# EAGLE design usb (EAGLE 4.16)
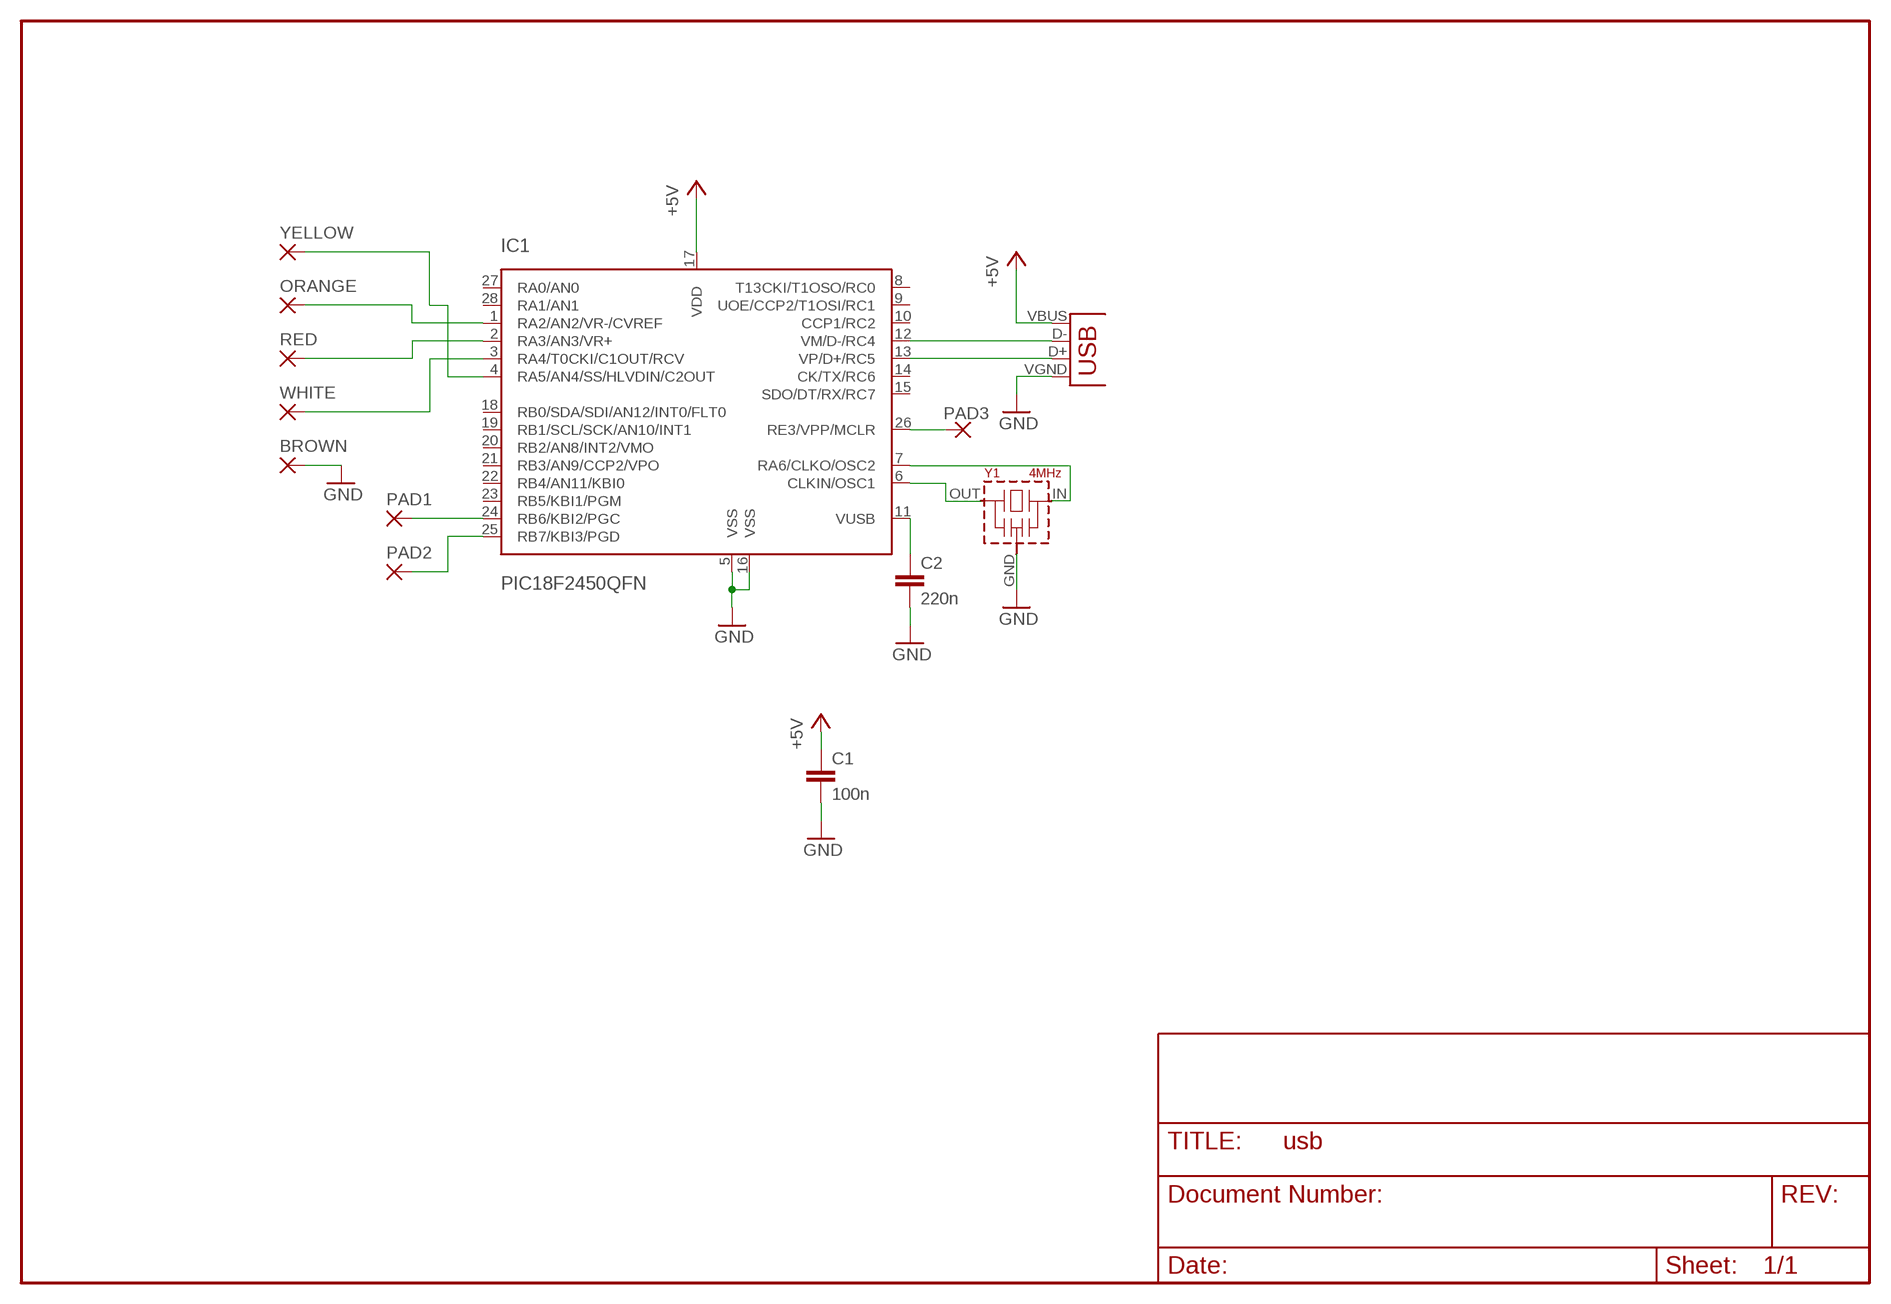
[diagram p0: schematic, sheet 1]

## Parts
BROWN  WIREPAD1,6/0,8  [1,6/0,8]
C1  100n  C-EUC0603  [C0603]
C2  220n  C-EUC1206  [C1206]
IC1  PIC18F2450QFN  [QFN-S28-6X6]
ORANGE  WIREPAD1,6/0,8  [1,6/0,8]
PAD1  SMD2  [SMD1,27-2,54]
PAD2  SMD2  [SMD1,27-2,54]
PAD3  SMD2  [SMD1,27-2,54]
RED  WIREPAD1,6/0,8  [1,6/0,8]
WHITE  WIREPAD1,6/0,8  [1,6/0,8]
X1  USB-A-SMT  [USB-A-SMT]
Y1  4MHz  CSTCCSMD  [CSTCC]
YELLOW  WIREPAD1,6/0,8  [1,6/0,8]

## Nets
+5V: C1.1 IC1.17(VDD) X1.VBUS
CLKIN: IC1.6(CLKIN/OSC1) Y1.OUT
CLKO: IC1.7(RA6/CLKO/OSC2) Y1.IN
D+: IC1.13(VP/D+/RC5) X1.D+
D-: IC1.12(VM/D-/RC4) X1.D-
GND: BROWN.1(P) C1.2 C2.2 IC1.5(VSS) IC1.16(VSS) X1.VGND(GND) Y1.GND(VSS)
PGC: IC1.24(RB6/KBI2/PGC) PAD1.1(P)
PGD: IC1.25(RB7/KBI3/PGD) PAD2.1(P)
SNES_CLK: IC1.4(RA5/AN4/SS/HLVDIN/C2OUT) YELLOW.1(P)
SNES_DAT: IC1.2(RA3/AN3/VR+) RED.1(P)
SNES_LAT: IC1.1(RA2/AN2/VR-/CVREF) ORANGE.1(P)
SNES_VCC: IC1.3(RA4/T0CKI/C1OUT/RCV) WHITE.1(P)
VPP: IC1.26(RE3/VPP/MCLR) PAD3.1(P)
VUSB: C2.1 IC1.11(VUSB)
Unconnected: IC1.8(T13CKI/T1OSO/RC0) IC1.9(UOE/CCP2/T1OSI/RC1) IC1.10(CCP1/RC2) IC1.14(CK/TX/RC6) IC1.15(SDO/DT/RX/RC7) IC1.18(RB0/SDA/SDI/AN12/INT0/FLT0) IC1.19(RB1/SCL/SCK/AN10/INT1) IC1.20(RB2/AN8/INT2/VMO) IC1.21(RB3/AN9/CCP2/VPO) IC1.22(RB4/AN11/KBI0) IC1.23(RB5/KBI1/PGM) IC1.27(RA0/AN0) IC1.28(RA1/AN1)

## Library data of the parts
BROWN ORANGE RED WHITE YELLOW = wirepad:WIREPAD: Wire PAD connect wire on PCB
C1 C2 = rcl:C-EU: CAPACITOR, European symbol
IC1 = microchip-dspic:PIC18F2450
PAD1-PAD3 = wirepad:SMD2: SMD PAD
X1 = con-usb:USB: USB Connectors
Y1 = murata-resonators:CSTCC

## Board
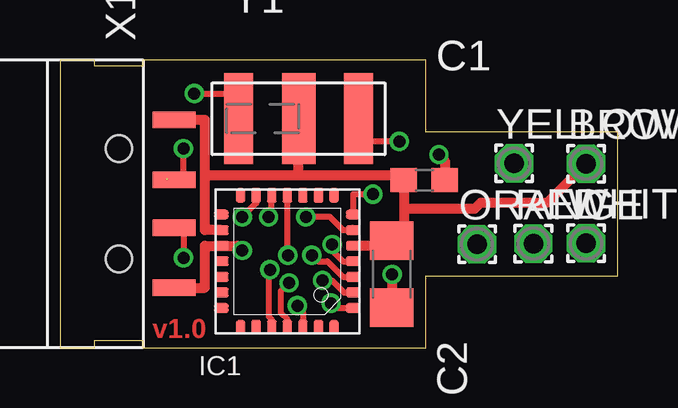
[diagram p1: board, top side]
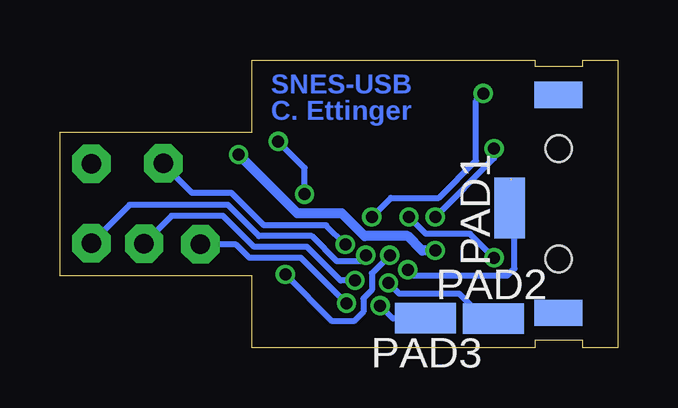
[diagram p2: board, bottom side, seen from below]

Size 23.25 x 12 mm. Coordinates in mm from the lower left corner, seen from the top.
Outline: 0,0 1.45,0 1.45,0.3 3.45,0.3 3.45,0 15.25,0 15.25,3 23.25,3 23.25,9 15.25,9 15.25,12 3.45,12 3.45,11.75 1.45,11.75 1.45,12 0,12 0,0
Copper layers (1*16): Top 0.035mm / dielectric 1.5mm / Bottom 0.035mm
Design rules "PCB-POOL": minimum track width 6mil, minimum drill 12mil, track to track 6mil, track to pad 6mil, pad to pad 6mil, via to via 6mil, smd to smd 6mil, copper to edge 20mil, drill to drill 8mil, minimum pad ring 8mil, minimum via ring 6mil, stop-mask expansion 3mil, vias tented up to drill 0mil, thermal gap 8mil

### Footprints (pad centres in the part's own frame; a part is rotated, then mirrored left to right if it is on the bottom)
1,6/0,8 = drill 0.813 pad 1.6 octagon: 1 0,0
C0603 = smd 1.1 x 1: 1 -0.85,0; 2 0.85,0
C1206 = smd 1.6 x 1.8: 1 -1.4,0; 2 1.4,0
QFN-S28-6X6 = smd 0.6 x 0.4: 1 2.75,-1.95; 2 2.75,-1.3; 3 2.75,-0.65; 4 2.75,0; 5 2.75,0.65; 6 2.75,1.3; 7 2.75,1.95; 15 -2.75,1.95; 16 -2.75,1.3; 17 -2.75,0.65; 18 -2.75,0; 19 -2.75,-0.65; 20 -2.75,-1.3; 21 -2.75,-1.95 | smd 0.4 x 0.6: 8 1.95,2.75; 9 1.3,2.75; 10 0.65,2.75; 11 0,2.75; 12 -0.65,2.75; 13 -1.3,2.75; 14 -1.95,2.75; 22 -1.95,-2.75; 23 -1.3,-2.75; 24 -0.65,-2.75; 25 0,-2.75; 26 0.65,-2.75; 27 1.3,-2.75; 28 1.95,-2.75
SMD1,27-2,54 = smd 1.27 x 2.54: 1 0,0
USB-A-SMT = smd 1.8 x 0.7: D+ 1.3,1; D- 1.3,-1; VBUS 1.3,-3.5; VGND 1.3,3.5 | smd 2 x 1.1 bottom: P$1 -1,4.55; P$2 -1,-4.55 | hole 1.1: -1,2.3; -1,-2.3
CSTCC = smd 1.4 x 3.8: GND 0,0 | smd 1.2 x 3.8: IN 2.5,0; OUT -2.5,0

### Placement (x,y rotation side)
BROWN  21.94,7.67 0 top
C1  15.19,6.98 180 top
C2  13.83,3.06 90 top
IC1  9.48,3.6 0 top
ORANGE  17.39,4.31 0 top
PAD1  4.5,5.82 0 bottom
PAD2  5.18,1.2 270 bottom
PAD3  8.02,1.22 90 bottom
RED  19.74,4.34 0 top
WHITE  21.94,4.35 0 top
X1  3.46,6 0 top
Y1  9.95,9.55 0 top
YELLOW  18.94,7.68 0 top

### Tracks (layer width: path | path; a pad name or v marks a point on that pad's centre or on a via)
+5V  (via drill 0.5)
  Top 0.406: X1.VBUS 6.05,2.5 6.05,4.25 IC1.17 7.4,4.25 v7.6,4.05 | v15.8,8.05 16.05,7.8 C1.1
  Bottom 0.406: v7.6,4.05 8.15,4.05 8.75,4.65 10.55,4.65 11.5,5.6 13.35,5.6 v15.8,8.05
CLKIN  (via drill 0.5)
  Top 0.254: v5.6,10.6 7.45,10.6 Y1.OUT | IC1.6 11.8,4.9 11.25,5.45 v10.25,5.45
  Top 0.406: IC1.6 12.15,4.9
  Bottom 0.254: v10.25,5.45 9.45,6.25 7.45,6.25 5.9,7.8 5.9,10.3 v5.6,10.6
CLKO  (via drill 0.5)
  Top 0.254: v14.15,8.6 12.45,8.6 Y1.IN | IC1.7 12.23,6.4 v13.05,6.4
  Top 0.406: Y1.IN 12.05,9.55 | IC1.7 12.15,5.55
  Bottom 0.254: v13.05,6.4 13.05,7.5 v14.15,8.6
D+  (via drill 0.5 pad 0.25)  (1 unrouted)
  Top 0.254: 4.45,7 X1.D+ 5.15,7 v5.15,8.3 | IC1.13 8.18,6.03 v7.6,5.45 | 4.45,7.05 4.46,7.05
  Bottom 0.254: v7.6,5.45 5.15,7.9 v5.15,8.3
D-  (via drill 0.5 pad 0.25)
  Top 0.254: X1.D- 4.45,5 | 4.15,5 X1.D- | IC1.12 8.83,5.58 v8.7,5.45 | X1.D- 5.15,5 v5.15,3.75
  Bottom 0.254: v8.7,5.45 8,4.75 6.15,4.75 v5.15,3.75
GND
  Top 0.406: IC1.5 13.85,4.25 13.85,4.46 C2.2 14.35,4.98 14.35,5.8 | 9.9,9.5 Y1.GND | 6.75,4.9 IC1.16 6.05,4.9 6.05,7.2 | 6.05,7.2 9.95,7.2 | 9.9,9.5 9.85,9.5 | 6.05,7.2 6.05,9.5 X1.VGND | BROWN.1 20.32,6.05 17.55,6.05 17.3,5.8 14.35,5.8 | 9.9,9.5 9.95,9.5 9.95,7.2 | 14.35,6.95 14.35,5.8 | 14.35,6.95 C1.2 14.35,6.95 | 9.95,7.2 14.35,7.2 14.35,6.95
PGC  (via drill 0.5 pad 0.25)
  Top 0.254: IC1.24 8.83,1.17 8.7,1.3 8.7,3.25 v8.75,3.25
  Bottom 0.254: PAD1.1 4.3,5.82 4.3,3.3 4.6,3 8.5,3 v8.75,3.25
PGD  (via drill 0.5 pad 0.25)
  Top 0.254: IC1.25 9.48,1.17 9.2,1.45 9.2,2.35 v9.55,2.7
  Bottom 0.254: PAD2.1 5.55,1.2 6.6,2.25 9.1,2.25 v9.55,2.7
SNES_CLK  (via drill 0.5 pad 0.25)
  Top 0.254: v11.35,4.3 11.35,4.05 11.8,3.6 IC1.4
  Bottom 0.254: v11.35,4.3 12.15,5.1 14.75,5.1 16.1,6.45 17.75,6.45 18.95,7.65 18.94,7.66 YELLOW.1
SNES_DAT  (via drill 0.5 pad 0.25)
  Top 0.254: IC1.2 11.85,2.3 11.35,2.8 v10.95,2.8
  Bottom 0.254: v10.95,2.8 11.55,2.8 12.95,4.2 15.15,4.2 16.45,5.5 18.6,5.5 RED.1
SNES_LAT  (via drill 0.5 pad 0.25)
  Top 0.254: IC1.1 11.5,1.65 v11.3,1.85
  Bottom 0.254: v11.3,1.85 13.2,3.75 15.35,3.75 15.9,4.3 17.35,4.3 17.36,4.31 ORANGE.1
SNES_VCC  (via drill 0.5 pad 0.25)
  Top 0.254: IC1.3 11.8,2.95 11.15,3.6 10.75,3.6 v10.5,3.85
  Bottom 0.254: v10.5,3.85 10.75,3.6 11.7,3.6 12.75,4.65 14.95,4.65 16.25,5.95 20.35,5.95 WHITE.1
VPP  (via drill 0.5 pad 0.25)
  Top 0.254: v9.9,1.75 9.85,1.75 10.13,1.47 IC1.26
  Bottom 0.254: PAD3.1 9.35,1.22 | 9.35,1.22 9.37,1.22 | 9.35,1.22 9.35,1.2 v9.9,1.75
VUSB  (via drill 0.5, 0.5 pad 0.25)
  Top 0.254: IC1.11 9.48,3.87 v9.5,3.85
  Top 0.406: C2.1 13.83,1.7 13.85,1.7 v13.85,3.05
  Bottom 0.254: v9.5,3.85 10.25,3.1 10.25,2.4 10.6,2.05 10.6,1.5 11,1.1 11.9,1.1 v13.85,3.05

### Text on the board
Top: v1.0
Bottom: SNES-USB | C. Ettinger